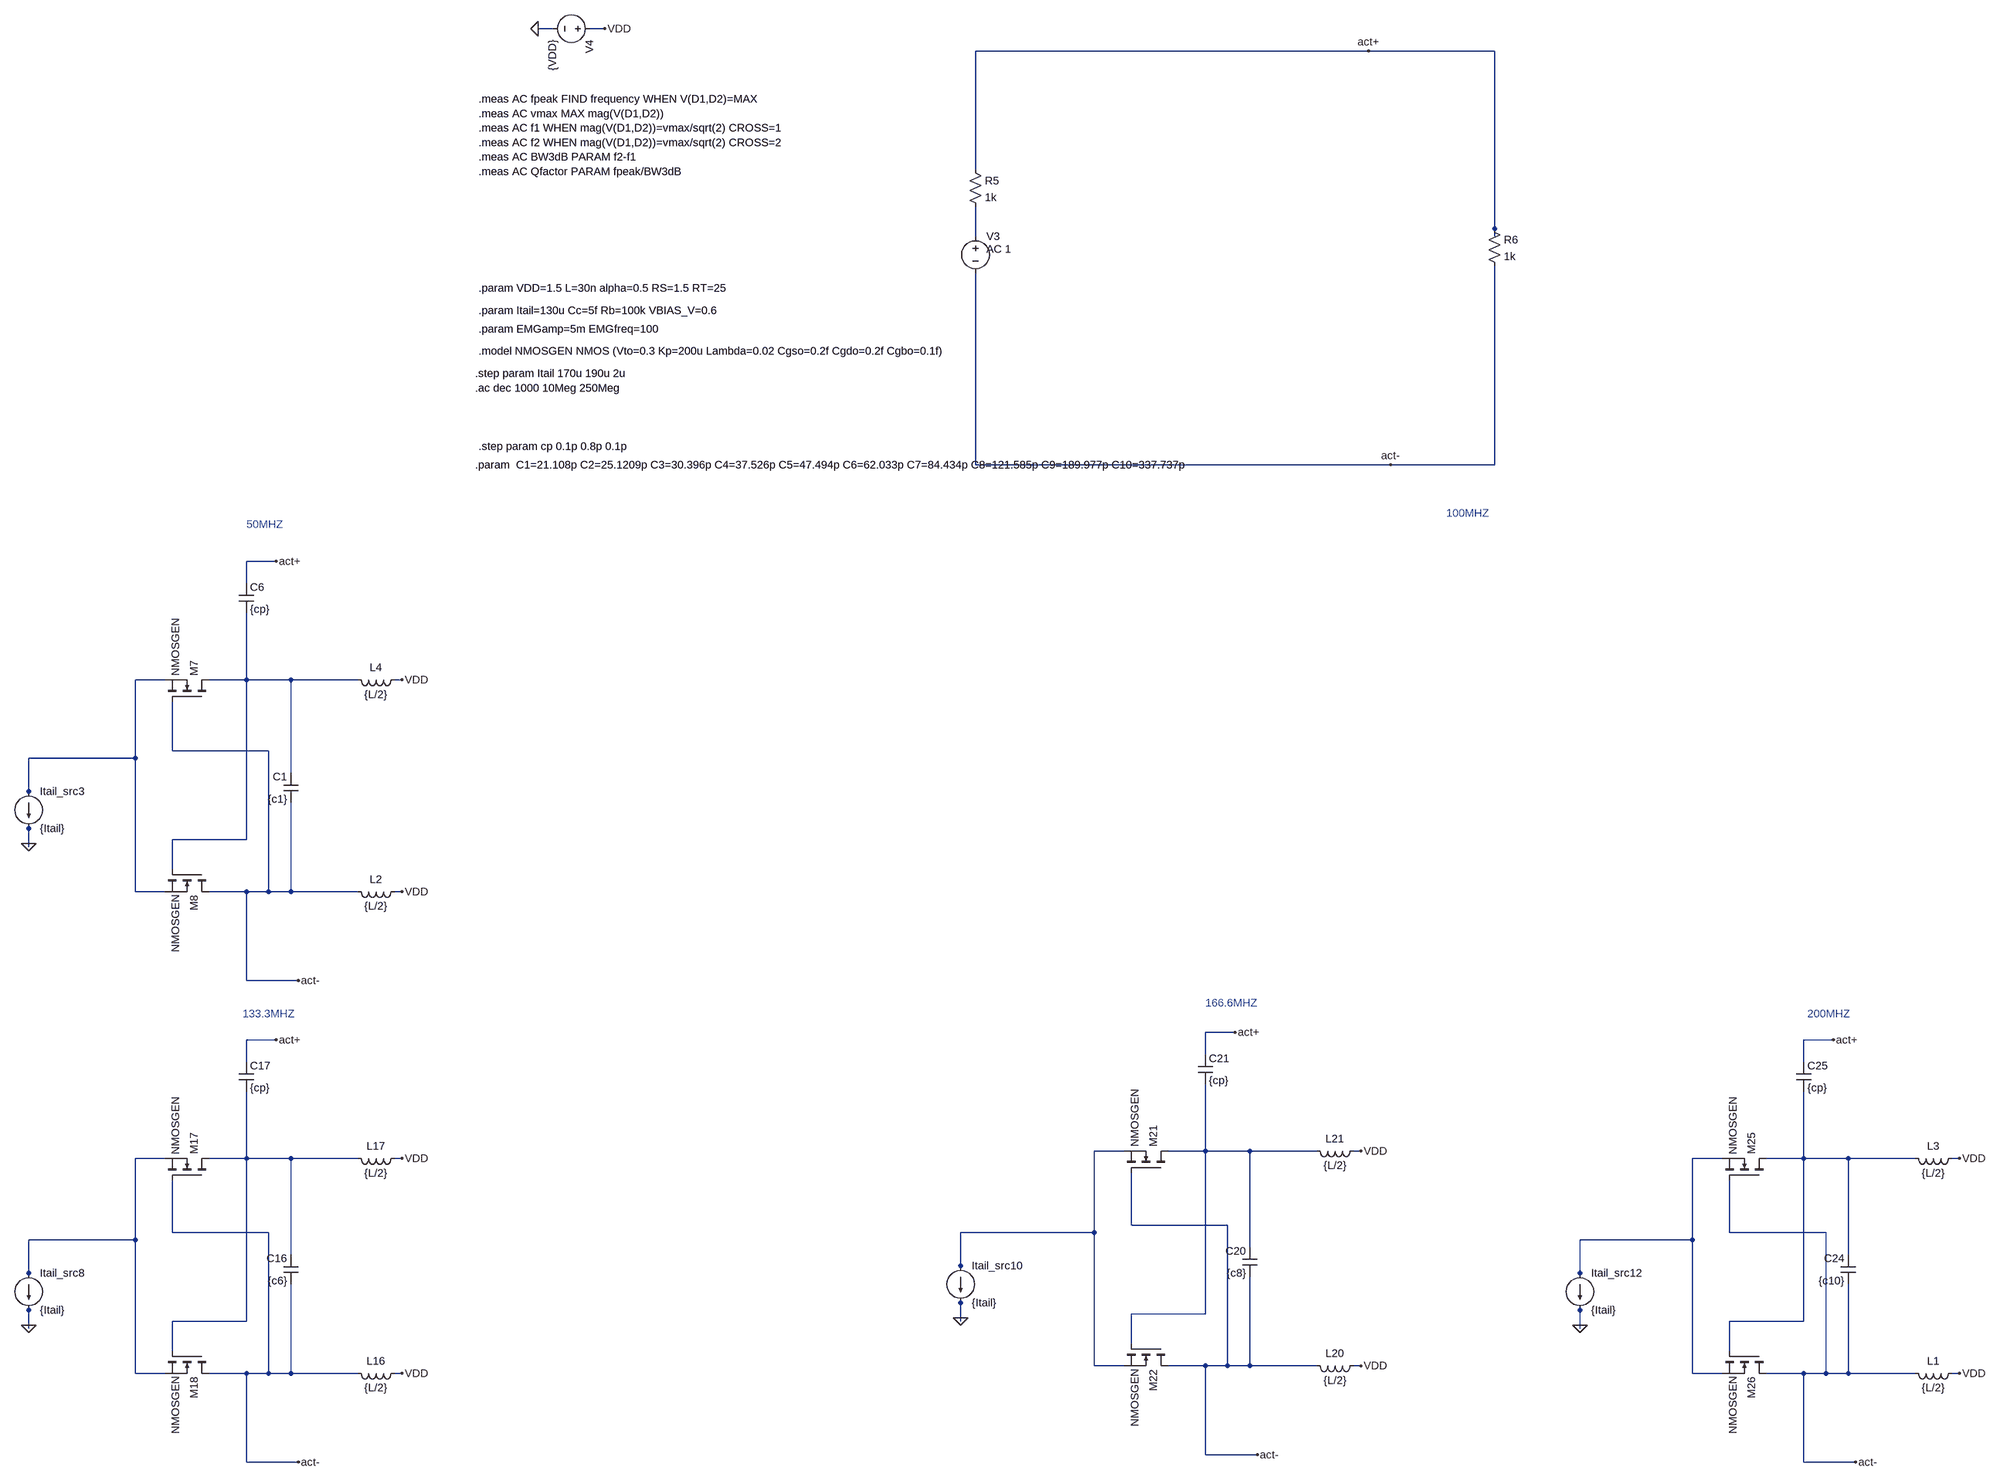
[diagram p0: schematic CROSS COUPLEDX10.asc]
CROSS COUPLEDX10.asc, the LTspice schematic file:
Version 4.1
SHEET 1 5816 3276
WIRE -2096 96 -2128 96
WIRE -1984 96 -2016 96
WIRE -336 144 -1184 144
WIRE 496 144 -336 144
WIRE -1184 400 -1184 144
WIRE 496 528 496 144
WIRE -1184 544 -1184 480
WIRE 496 544 496 528
WIRE -1184 1056 -1184 624
WIRE -288 1056 -1184 1056
WIRE 496 1056 496 608
WIRE 496 1056 -288 1056
WIRE -2960 1264 -3024 1264
WIRE -3024 1312 -3024 1264
WIRE -3200 1520 -3264 1520
WIRE -3024 1520 -3024 1376
WIRE -3024 1520 -3104 1520
WIRE -2928 1520 -3024 1520
WIRE -2784 1520 -2928 1520
WIRE -2688 1520 -2704 1520
WIRE -3184 1680 -3184 1568
WIRE -2976 1680 -3184 1680
WIRE -3264 1696 -3264 1520
WIRE -3264 1696 -3552 1696
WIRE -2928 1728 -2928 1520
WIRE -3552 1768 -3552 1696
WIRE -3552 1776 -3552 1768
WIRE -3552 1848 -3552 1840
WIRE -3024 1872 -3024 1520
WIRE -3024 1872 -3184 1872
WIRE -3552 1880 -3552 1848
WIRE -3552 1888 -3552 1880
WIRE -3184 1936 -3184 1872
WIRE -3264 1984 -3264 1696
WIRE -3200 1984 -3264 1984
WIRE -3024 1984 -3104 1984
WIRE -2976 1984 -2976 1680
WIRE -2976 1984 -3024 1984
WIRE -2928 1984 -2928 1792
WIRE -2928 1984 -2976 1984
WIRE -2784 1984 -2928 1984
WIRE -2688 1984 -2704 1984
WIRE -3024 2176 -3024 1984
WIRE -2912 2176 -3024 2176
WIRE -624 2288 -688 2288
WIRE -2960 2304 -3024 2304
WIRE 1664 2304 1600 2304
WIRE -688 2336 -688 2288
WIRE -3024 2352 -3024 2304
WIRE 1600 2352 1600 2304
WIRE -864 2544 -928 2544
WIRE -688 2544 -688 2400
WIRE -688 2544 -768 2544
WIRE -592 2544 -688 2544
WIRE -448 2544 -592 2544
WIRE -352 2544 -368 2544
WIRE -3200 2560 -3264 2560
WIRE -3024 2560 -3024 2416
WIRE -3024 2560 -3104 2560
WIRE -2928 2560 -3024 2560
WIRE -2784 2560 -2928 2560
WIRE -2688 2560 -2704 2560
WIRE 1424 2560 1360 2560
WIRE 1600 2560 1600 2416
WIRE 1600 2560 1520 2560
WIRE 1696 2560 1600 2560
WIRE 1840 2560 1696 2560
WIRE 1936 2560 1920 2560
WIRE -848 2704 -848 2592
WIRE -640 2704 -848 2704
WIRE -3184 2720 -3184 2608
WIRE -2976 2720 -3184 2720
WIRE -928 2720 -928 2544
WIRE -928 2720 -1216 2720
WIRE 1440 2720 1440 2608
WIRE 1648 2720 1440 2720
WIRE -3264 2736 -3264 2560
WIRE -3264 2736 -3552 2736
WIRE 1360 2736 1360 2560
WIRE 1360 2736 1072 2736
WIRE -592 2752 -592 2544
WIRE -2928 2768 -2928 2560
WIRE 1696 2768 1696 2560
WIRE -1216 2792 -1216 2720
WIRE -1216 2800 -1216 2792
WIRE -3552 2808 -3552 2736
WIRE 1072 2808 1072 2736
WIRE -3552 2816 -3552 2808
WIRE 1072 2816 1072 2808
WIRE -1216 2872 -1216 2864
WIRE -3552 2888 -3552 2880
WIRE 1072 2888 1072 2880
WIRE -688 2896 -688 2544
WIRE -688 2896 -848 2896
WIRE -1216 2904 -1216 2872
WIRE -3024 2912 -3024 2560
WIRE -3024 2912 -3184 2912
WIRE -1216 2912 -1216 2904
WIRE 1600 2912 1600 2560
WIRE 1600 2912 1440 2912
WIRE -3552 2920 -3552 2888
WIRE 1072 2920 1072 2888
WIRE -3552 2928 -3552 2920
WIRE 1072 2928 1072 2920
WIRE -848 2960 -848 2896
WIRE -3184 2976 -3184 2912
WIRE 1440 2976 1440 2912
WIRE -928 3008 -928 2720
WIRE -864 3008 -928 3008
WIRE -688 3008 -768 3008
WIRE -640 3008 -640 2704
WIRE -640 3008 -688 3008
WIRE -592 3008 -592 2816
WIRE -592 3008 -640 3008
WIRE -448 3008 -592 3008
WIRE -352 3008 -368 3008
WIRE -3264 3024 -3264 2736
WIRE -3200 3024 -3264 3024
WIRE -3024 3024 -3104 3024
WIRE -2976 3024 -2976 2720
WIRE -2976 3024 -3024 3024
WIRE -2928 3024 -2928 2832
WIRE -2928 3024 -2976 3024
WIRE -2784 3024 -2928 3024
WIRE -2688 3024 -2704 3024
WIRE 1360 3024 1360 2736
WIRE 1424 3024 1360 3024
WIRE 1600 3024 1520 3024
WIRE 1648 3024 1648 2720
WIRE 1648 3024 1600 3024
WIRE 1696 3024 1696 2832
WIRE 1696 3024 1648 3024
WIRE 1840 3024 1696 3024
WIRE 1936 3024 1920 3024
WIRE -688 3200 -688 3008
WIRE -576 3200 -688 3200
WIRE -3024 3216 -3024 3024
WIRE -2912 3216 -3024 3216
WIRE 1600 3216 1600 3024
WIRE 1712 3216 1600 3216
FLAG -1984 96 VDD
FLAG -2128 96 0
FLAG -336 144 act+
FLAG -288 1056 act-
FLAG -2688 1984 VDD
FLAG -2688 1520 VDD
FLAG -3552 1880 0
FLAG -2960 1264 act+
FLAG -2912 2176 act-
FLAG -2688 3024 VDD
FLAG -2688 2560 VDD
FLAG -3552 2920 0
FLAG -2960 2304 act+
FLAG -2912 3216 act-
FLAG -352 3008 VDD
FLAG -352 2544 VDD
FLAG -1216 2904 0
FLAG -624 2288 act+
FLAG -576 3200 act-
FLAG 1936 3024 VDD
FLAG 1936 2560 VDD
FLAG 1072 2920 0
FLAG 1664 2304 act+
FLAG 1712 3216 act-
SYMBOL voltage -2000 96 R90
WINDOW 123 0 0 Left 0
WINDOW 39 0 0 Left 0
SYMATTR InstName V4
SYMATTR Value {VDD}
SYMBOL voltage -1184 528 R0
WINDOW 123 24 44 Left 2
WINDOW 39 0 0 Left 0
SYMATTR Value2 AC 1
SYMATTR InstName V3
SYMATTR Value ""
SYMBOL res -1200 384 R0
SYMATTR InstName R5
SYMATTR Value 1k
SYMBOL res 480 512 R0
SYMATTR InstName R6
SYMATTR Value 1k
SYMBOL nmos -3104 1568 M270
SYMATTR InstName M7
SYMATTR Value NMOSGEN
SYMBOL nmos -3104 1936 R90
SYMATTR InstName M8
SYMATTR Value NMOSGEN
SYMBOL ind -2688 1968 R90
WINDOW 0 5 56 VBottom 2
WINDOW 3 32 56 VTop 2
SYMATTR InstName L2
SYMATTR Value {L/2}
SYMATTR SpiceLine Rser={RS/2}
SYMBOL ind -2688 1504 R90
WINDOW 0 5 56 VBottom 2
WINDOW 3 32 56 VTop 2
SYMATTR InstName L4
SYMATTR Value {L/2}
SYMATTR SpiceLine Rser={RS/2}
SYMBOL cap -2912 1792 R180
WINDOW 0 24 56 Left 2
WINDOW 3 24 8 Left 2
SYMATTR InstName C1
SYMATTR Value {c1}
SYMBOL cap -3040 1312 R0
SYMATTR InstName C6
SYMATTR Value {cp}
SYMBOL current -3552 1768 R0
SYMATTR InstName Itail_src3
SYMATTR Value {Itail}
SYMBOL nmos -3104 2608 M270
SYMATTR InstName M17
SYMATTR Value NMOSGEN
SYMBOL nmos -3104 2976 R90
SYMATTR InstName M18
SYMATTR Value NMOSGEN
SYMBOL ind -2688 3008 R90
WINDOW 0 5 56 VBottom 2
WINDOW 3 32 56 VTop 2
SYMATTR InstName L16
SYMATTR Value {L/2}
SYMATTR SpiceLine Rser={RS/2}
SYMBOL ind -2688 2544 R90
WINDOW 0 5 56 VBottom 2
WINDOW 3 32 56 VTop 2
SYMATTR InstName L17
SYMATTR Value {L/2}
SYMATTR SpiceLine Rser={RS/2}
SYMBOL cap -2912 2832 R180
WINDOW 0 24 56 Left 2
WINDOW 3 24 8 Left 2
SYMATTR InstName C16
SYMATTR Value {c6}
SYMBOL cap -3040 2352 R0
SYMATTR InstName C17
SYMATTR Value {cp}
SYMBOL current -3552 2808 R0
SYMATTR InstName Itail_src8
SYMATTR Value {Itail}
SYMBOL nmos -768 2592 M270
SYMATTR InstName M21
SYMATTR Value NMOSGEN
SYMBOL nmos -768 2960 R90
SYMATTR InstName M22
SYMATTR Value NMOSGEN
SYMBOL ind -352 2992 R90
WINDOW 0 5 56 VBottom 2
WINDOW 3 32 56 VTop 2
SYMATTR InstName L20
SYMATTR Value {L/2}
SYMATTR SpiceLine Rser={RS/2}
SYMBOL ind -352 2528 R90
WINDOW 0 5 56 VBottom 2
WINDOW 3 32 56 VTop 2
SYMATTR InstName L21
SYMATTR Value {L/2}
SYMATTR SpiceLine Rser={RS/2}
SYMBOL cap -576 2816 R180
WINDOW 0 24 56 Left 2
WINDOW 3 24 8 Left 2
SYMATTR InstName C20
SYMATTR Value {c8}
SYMBOL cap -704 2336 R0
SYMATTR InstName C21
SYMATTR Value {cp}
SYMBOL current -1216 2792 R0
SYMATTR InstName Itail_src10
SYMATTR Value {Itail}
SYMBOL nmos 1520 2608 M270
SYMATTR InstName M25
SYMATTR Value NMOSGEN
SYMBOL nmos 1520 2976 R90
SYMATTR InstName M26
SYMATTR Value NMOSGEN
SYMBOL cap 1712 2832 R180
WINDOW 0 24 56 Left 2
WINDOW 3 24 8 Left 2
SYMATTR InstName C24
SYMATTR Value {c10}
SYMBOL cap 1584 2352 R0
SYMATTR InstName C25
SYMATTR Value {cp}
SYMBOL current 1072 2808 R0
SYMATTR InstName Itail_src12
SYMATTR Value {Itail}
SYMBOL ind 1936 3008 R90
WINDOW 0 5 56 VBottom 2
WINDOW 3 32 56 VTop 2
SYMATTR InstName L1
SYMATTR Value {L/2}
SYMATTR SpiceLine Rser={RS/2}
SYMBOL ind 1936 2544 R90
WINDOW 0 5 56 VBottom 2
WINDOW 3 32 56 VTop 2
SYMATTR InstName L3
SYMATTR Value {L/2}
SYMATTR SpiceLine Rser={RS/2}
TEXT -2256 656 Left 2 !.param VDD=1.5 L=30n alpha=0.5 RS=1.5 RT=25
TEXT -2256 704 Left 2 !.param Itail=130u Cc=5f Rb=100k VBIAS_V=0.6
TEXT -2256 744 Left 2 !.param EMGamp=5m EMGfreq=100
TEXT -2256 792 Left 2 !.model NMOSGEN NMOS (Vto=0.3 Kp=200u Lambda=0.02 Cgso=0.2f Cgdo=0.2f Cgbo=0.1f)
TEXT -2264 840 Left 2 !.step param Itail 170u 190u 2u
TEXT -2264 872 Left 2 !.ac dec 1000 10Meg 250Meg
TEXT -2256 1016 Left 2 !.step param cp 0.1p 0.8p 0.1p
TEXT -2256 248 Left 2 !.meas AC fpeak FIND frequency WHEN V(D1,D2)=MAX\n.meas AC vmax MAX mag(V(D1,D2))\n.meas AC f1 WHEN mag(V(D1,D2))=vmax/sqrt(2) CROSS=1\n.meas AC f2 WHEN mag(V(D1,D2))=vmax/sqrt(2) CROSS=2\n.meas AC BW3dB PARAM f2-f1\n.meas AC Qfactor PARAM fpeak/BW3dB
TEXT -3024 1184 Left 2 ;50MHZ
TEXT 392 1160 Left 2 ;100MHZ
TEXT -3032 2248 Left 2 ;133.3MHZ
TEXT -688 2224 Left 2 ;166.6MHZ
TEXT 1608 2248 Left 2 ;200MHZ
TEXT -2264 1056 Left 2 !.param  C1=21.108p C2=25.1209p C3=30.396p C4=37.526p C5=47.494p C6=62.033p C7=84.434p C8=121.585p C9=189.977p C10=337.737p

The netlist it stands for:
* CROSS COUPLEDX10.asc
V4 VDD 0 {VDD}
V3 N001 act- AC 1
R5 act+ N001 1k
R6 act+ act- 1k
M7 N003 act- N002 N002 NMOSGEN
M8 act- N003 N002 N002 NMOSGEN
L2 VDD act- {L/2} Rser={RS/2}
L4 VDD N003 {L/2} Rser={RS/2}
C1 act- N003 {c1}
C6 act+ N003 {cp}
Itail_src3 N002 0 {Itail}
M17 N007 act- N006 N006 NMOSGEN
M18 act- N007 N006 N006 NMOSGEN
L16 VDD act- {L/2} Rser={RS/2}
L17 VDD N007 {L/2} Rser={RS/2}
C16 act- N007 {c6}
C17 act+ N007 {cp}
Itail_src8 N006 0 {Itail}
M21 N005 act- N004 N004 NMOSGEN
M22 act- N005 N004 N004 NMOSGEN
L20 VDD act- {L/2} Rser={RS/2}
L21 VDD N005 {L/2} Rser={RS/2}
C20 act- N005 {c8}
C21 act+ N005 {cp}
Itail_src10 N004 0 {Itail}
M25 N009 act- N008 N008 NMOSGEN
M26 act- N009 N008 N008 NMOSGEN
C24 act- N009 {c10}
C25 act+ N009 {cp}
Itail_src12 N008 0 {Itail}
L1 VDD act- {L/2} Rser={RS/2}
L3 VDD N009 {L/2} Rser={RS/2}
.model NMOS NMOS
.model PMOS PMOS
.lib standard.mos
.param VDD=1.5 L=30n alpha=0.5 RS=1.5 RT=25
.param Itail=130u Cc=5f Rb=100k VBIAS_V=0.6
.param EMGamp=5m EMGfreq=100
.model NMOSGEN NMOS (Vto=0.3 Kp=200u Lambda=0.02 Cgso=0.2f Cgdo=0.2f Cgbo=0.1f)
.step param Itail 170u 190u 2u
.ac dec 1000 10Meg 250Meg
.step param cp 0.1p 0.8p 0.1p
.meas AC fpeak FIND frequency WHEN V(D1,D2)=MAX
.meas AC vmax MAX mag(V(D1,D2))
.meas AC f1 WHEN mag(V(D1,D2))=vmax/sqrt(2) CROSS=1
.meas AC f2 WHEN mag(V(D1,D2))=vmax/sqrt(2) CROSS=2
.meas AC BW3dB PARAM f2-f1
.meas AC Qfactor PARAM fpeak/BW3dB
* 50MHZ
* 100MHZ
* 133.3MHZ
* 166.6MHZ
* 200MHZ
.param  C1=21.108p C2=25.1209p C3=30.396p C4=37.526p C5=47.494p C6=62.033p C7=84.434p C8=121.585p C9=189.977p C10=337.737p
.backanno
.end